# Altium project ic555 tao xung.PrjPcb
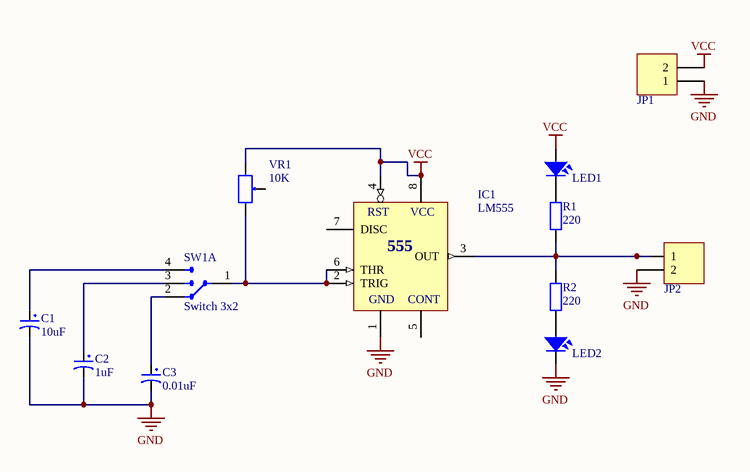
[diagram p0: IC555 tao xung.SchDoc]
1 sheet, 12 parts. Net scope: global (net labels, ports and power ports of the same name join across sheets).

## Sheet IC555 tao xung.SchDoc
size A; SheetNumber: 1; SheetTotal: 1

### Parts
C1  10uF  [CP1.5/3.4]
C2  1uF  [CP1.5/3.4]
C3  0.01uF  [CP1.5/3.4]
IC1  LM555  [DIP8/W0.3]
JP1  Header 2_1  [HED2]  (value not drawn)
JP2  Header 2_1  [HED2]  (value not drawn)
LED1  LED  [LED-3]  (value not drawn)
LED2  LED  [LED-3]  (value not drawn)
R1  220  [R1/4W]
R2  220  [R1/4W]
SW1  Switch 3x2  [SW3X2]  (part A of 2)
VR1  10K  [VR]

### Nets
GND: C1.2 C2.2 C3.2 IC1.1(GND) JP1.1 JP2.2 LED2.2
VCC: IC1.4(RST) IC1.8(VCC) JP1.2 LED1.1 VR1.1
NetC1_1: C1.1 SW1.4(I/O3)
NetC2_1: C2.1 SW1.3(I/O2)
NetC3_1: C3.1 SW1.2(I/O1)
NetIC1_2: IC1.2(TRIG) IC1.6(THR) SW1.1(Com) VR1.3
NetIC1_3: IC1.3(OUT) JP2.1 R1.1 R2.2
NetLED1_2: LED1.2 R1.2
NetLED2_1: LED2.1 R2.1

Not connected (* = marked no-connect by the designer): IC1 5(CONT) 7(DISC); VR1 2

### Notes on the sheet
- (in symbol LM555) 555

### Library data of the parts
C1-C3 = CP3: Cap 100uF/35V - 470uF/16V; Value: 100uF/35V/50V; Description 1: 1000uF/6,3V - 470uF/16V - 330uF - 25V; Description 2: 220uF/35V - 100uF/50V - 63V - 4,7uF/200V; Description 3: 22uF => 33uF100V - 3,3uF => 4,7uF/250V; Description 4: 2,2uF =>3,3uF/350 - 2,2uF/400V - 1uF/450V
IC1 = LM555: Timer; Value: LM555
JP1 JP2 = Header 2_1: Header, 2-Pin; Manufacturer: Generic Components; Class: Connector; Value: Header 2
LED1 LED2 = LED: LED Single colour Green and Red; Value: LED 3 ly Single Colour
R1 R2 = R1/4W: Resistor 1/4W; Value: R1/4W - 1K
SW1 = SW3x2: Value: Switch 4x2
VR1 = VR: Var Resistor; Value: VR 10K